# EasyEDA schematic schematic.json
TITLE: Sheet_1; REV: 1.0; Date: 2019-03-19; Sheet: 1/1; Drawn By: saikek; Company: Your Company
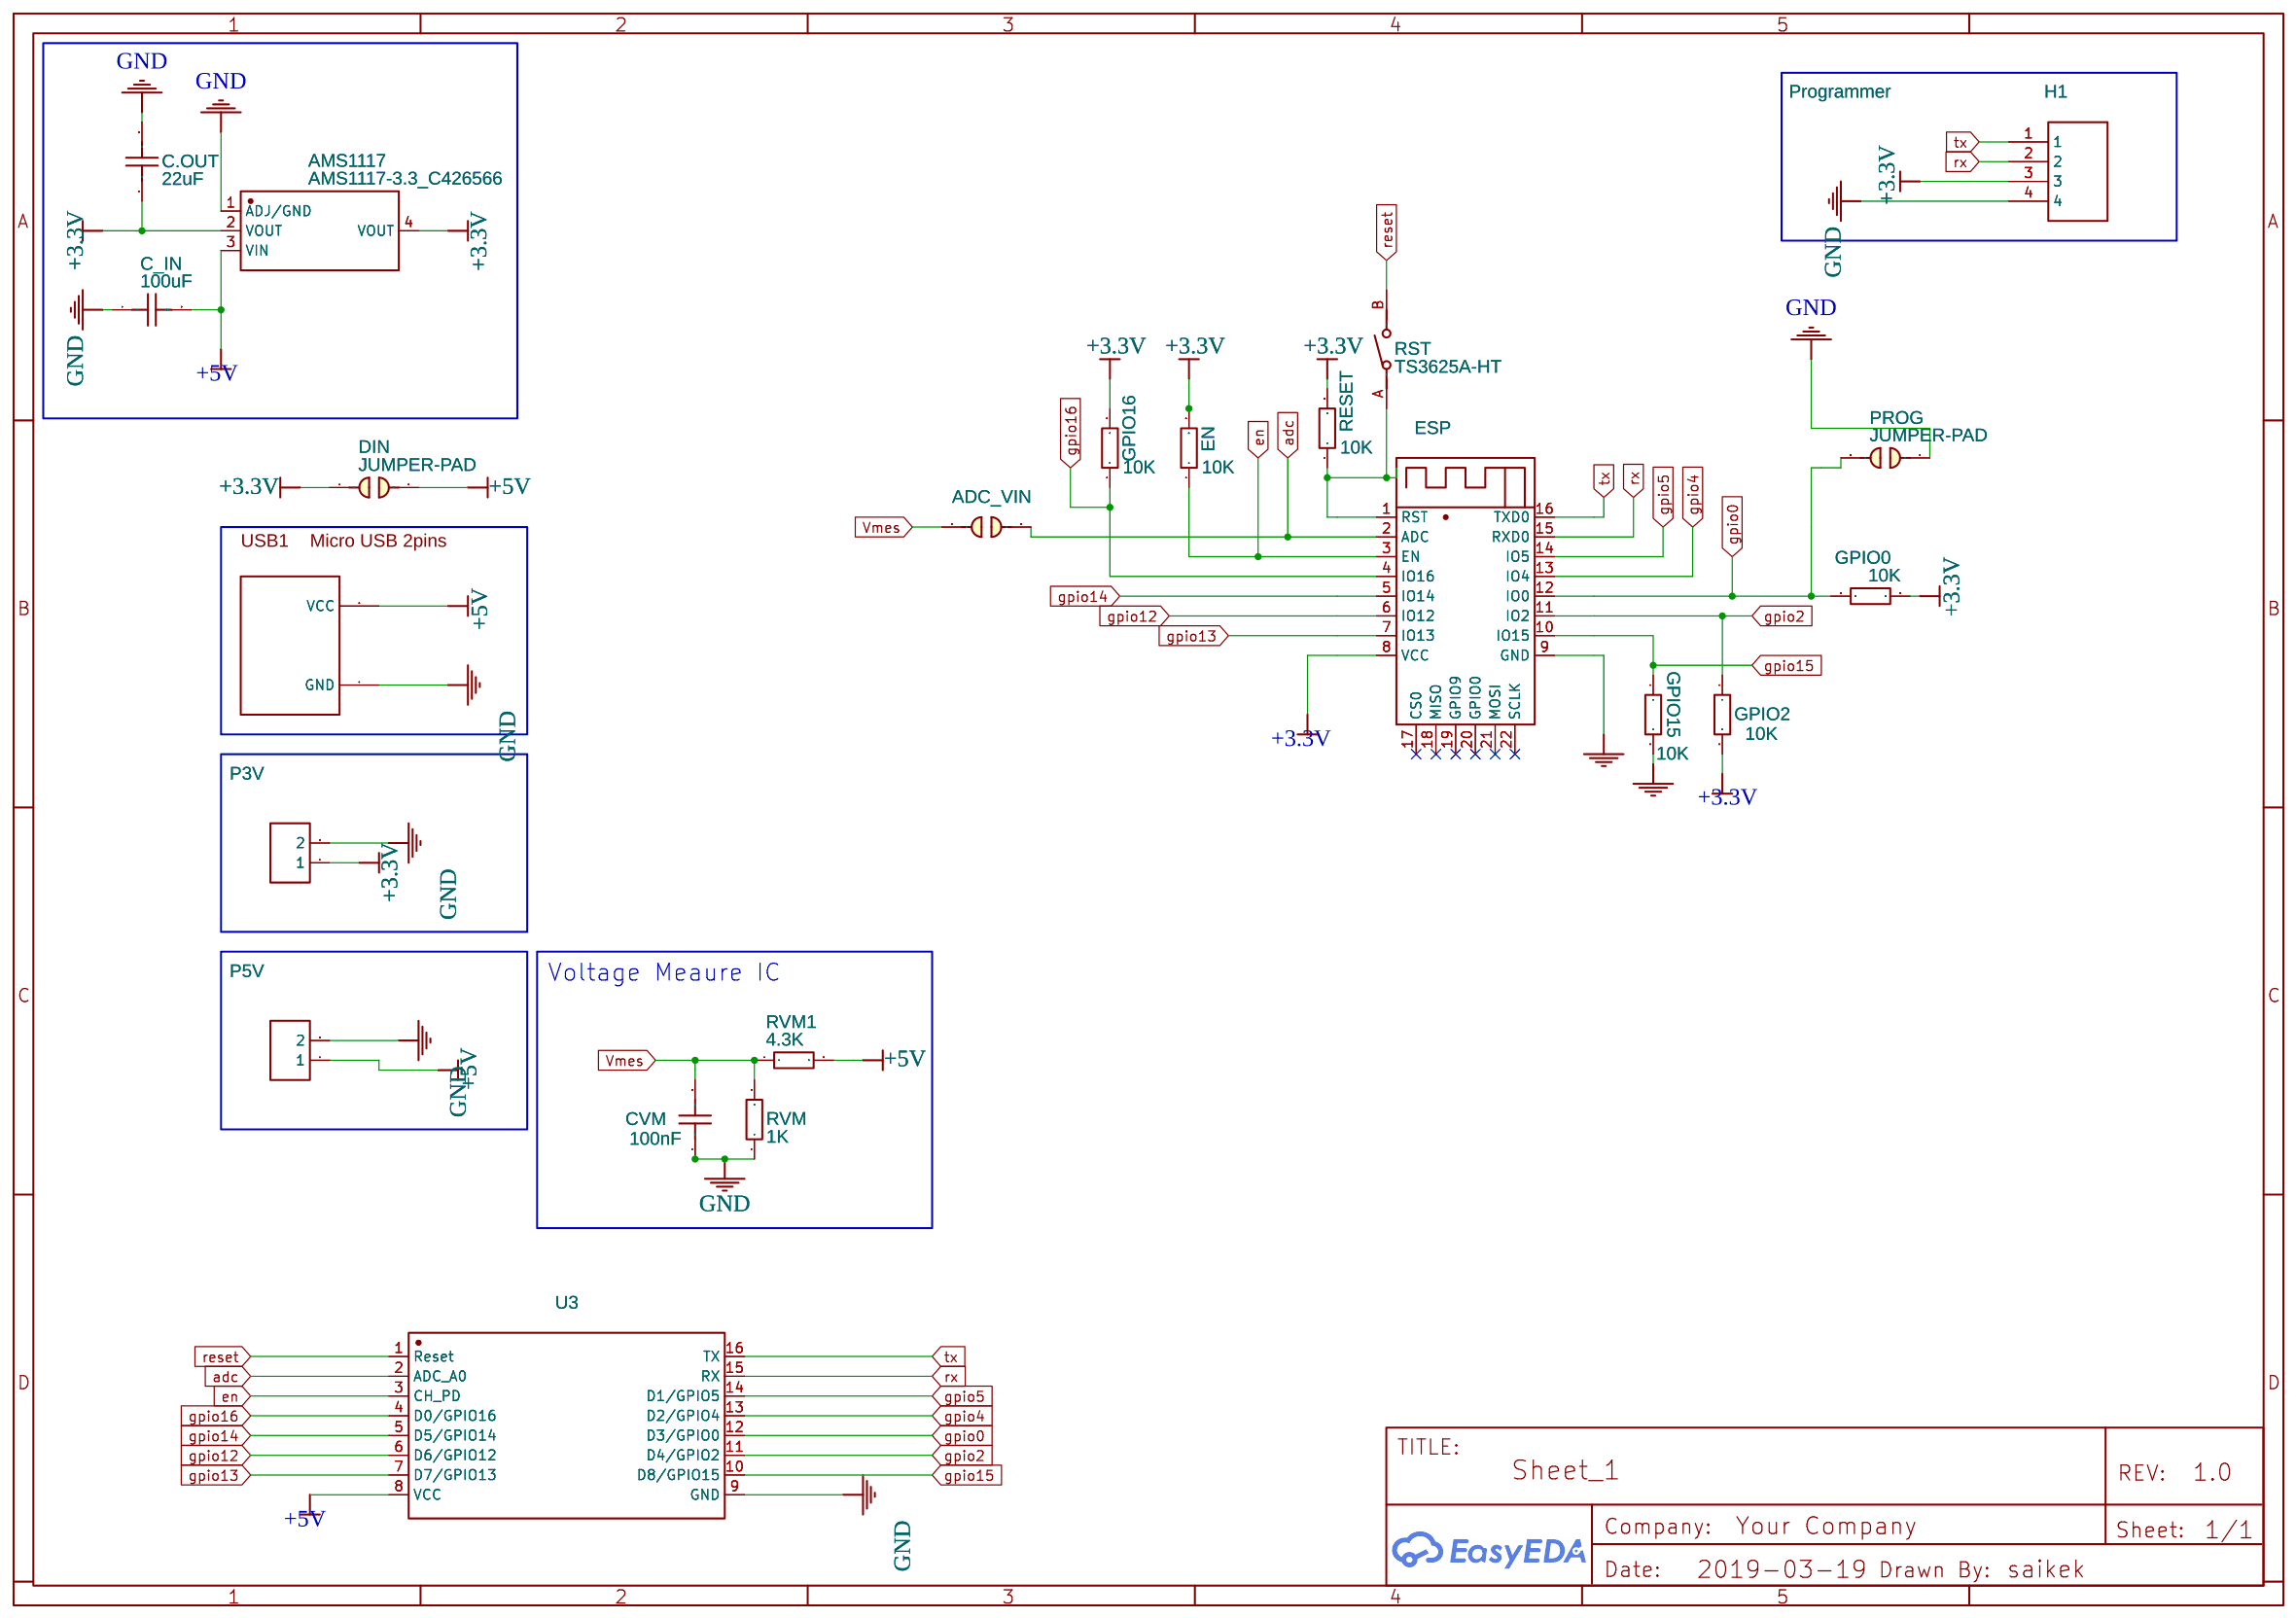
[diagram p0: schematic sheet]

## Parts
ADC_VIN  JUMPER-PAD  [PAD-JUMPER-2-NO_NO_SILK]
AMS1117  AMS1117-3.3_C426566  [SOT-223_L6.5-W3.5-P2.30-LS7.0-BR]
C.OUT  22uF  [C0805]
C_IN  100uF  [C1206]
CVM  100nF  [C1206]
DIN  JUMPER-PAD  [PAD-JUMPER-2-NO_NO_SILK]
EN  10K  [R1206]
ESP  WT8266-S5 ESP-12F  [WIFIM-SMD_22P-L24.0-W16.0-P2.00]
GPIO0  10K  [R1206]
GPIO2  10K  [R1206]
GPIO15  10K  [R1206]
GPIO16  10K  [R1206]
H1  Programmer  [DIP-2X2P2.54]
P3V  Header-Female-2.54_1x2  [HDR-TH_2P-P2.54-V-M]
P5V  Header-Female-2.54_1x2  [HDR-TH_2P-P2.54-V-M]
PROG  JUMPER-PAD  [PAD-JUMPER-2-NO_NO_SILK]
RESET  10K  [R1206]
RST  TS3625A-HT  [SW-SMD_L6.1-W3.7-LS7.9]
RVM  1K  [R1206]
RVM1  4.3K  [R1206]
U3  Esp8266_witty  [ESP8266_WITTY_12F]
U4  MicroUSB 2 pins female  [USB 2 PIN FEMALE]

## Library data of the parts
ADC_VIN DIN PROG = JUMPER-PAD: Contributor: SparkFun
AMS1117 = -: Supplier: LCSC; Supplier Part: C426566; Manufacturer: SLKORMICRO Elec.; Manufacturer Part: AMS1117-3.3; Contributor: LCSC
C.OUT = LMK212BJ226MG-T: Supplier: LCSC; Manufacturer: TAIYO YUDEN; Supplier Part: C92814
C_IN CVM = FS31B107M6R3EPG: Supplier: LCSC; Supplier Part: C363564; Manufacturer: Prosperity Dielectrics; Contributor: LCSC
EN GPIO0 GPIO2 GPIO15 GPIO16 RESET RVM RVM1 = QR1206J10KP05: Supplier: LCSC; Supplier Part: C176266; Manufacturer: Ever Ohms Tech; Contributor: LCSC
ESP = WT8266-S5 ESP-12F: Supplier: LCSC; Supplier Part: C477829; Manufacturer: Wireless-tag; Contributor: LCSC
H1 = -: Supplier: LCSC; Manufacturer: Ckmtw; Manufacturer Part: 220S-1*4P H=8.5MM Ytype Gold-plated; Contributor: LCSC; Supplier Part: C124413
P3V P5V = Header-Female-2.54_1x2: Supplier: LCSC; Manufacturer: BOOMELE; Manufacturer Part: 2.54-1*2PFemale; image: //image.lceda.cn/szlcsc/C49661.jpg; Supplier Part: C49661
RST = TS3625A-HT: Supplier: LCSC; Supplier Part: C412368; Manufacturer: SHOU HAN; Contributor: LCSC
U3 = -: Contributor: Victor Produsevich
U4 = -: Contributor: CyberneticsCore

## Nets
+3.3V: AMS1117.2(VOUT) AMS1117.4(VOUT) C.OUT.1 DIN.1 EN.2 ESP.8(VCC) GPIO0.2 GPIO2.2 GPIO16.2 H1.3 P3V.1 RESET.2
+5V: AMS1117.3(VIN) C_IN.2 DIN.2 P5V.1 RVM1.2 U3.8(VCC) U4.2(VCC)
GND: AMS1117.1(ADJ/GND) C.OUT.2 C_IN.1 CVM.1 ESP.9(GND) GPIO15.2 H1.4 P3V.2 P5V.2 PROG.1 RVM.1 U3.9(GND) U4.1(GND)
adc: ADC_VIN.2 ESP.2(ADC) U3.2(ADC_A0)
en: EN.1 ESP.3(EN) U3.3(CH_PD)
gpio0: ESP.12(IO0) GPIO0.1 PROG.2 U3.12(D3/GPIO0)
gpio2: ESP.11(IO2) GPIO2.1 U3.11(D4/GPIO2)
gpio4: ESP.13(IO4) U3.13(D2/GPIO4)
gpio5: ESP.14(IO5) U3.14(D1/GPIO5)
gpio12: ESP.6(IO12) U3.6(D6/GPIO12)
gpio13: ESP.7(IO13) U3.7(D7/GPIO13)
gpio14: ESP.5(IO14) U3.5(D5/GPIO14)
gpio15: ESP.10(IO15) GPIO15.1 U3.10(D8/GPIO15)
gpio16: ESP.4(IO16) GPIO16.1 U3.4(D0/GPIO16)
reset: RST.B U3.1(Reset)
rx: ESP.15(RXD0) H1.2 U3.15(RX)
tx: ESP.16(TXD0) H1.1 U3.16(TX)
Vmes: ADC_VIN.1 CVM.2 RVM.2 RVM1.1
Net-(ESP-1): ESP.1(RST) RESET.1 RST.A

Not connected (* = marked no-connect by the designer): ESP 17(CS0)* 18(MISO)* 19(GPIO9)* 20(GPIO0)* 21(MOSI)* 22(SCLK)*

## Notes on the sheet
- Voltage Meaure IC
